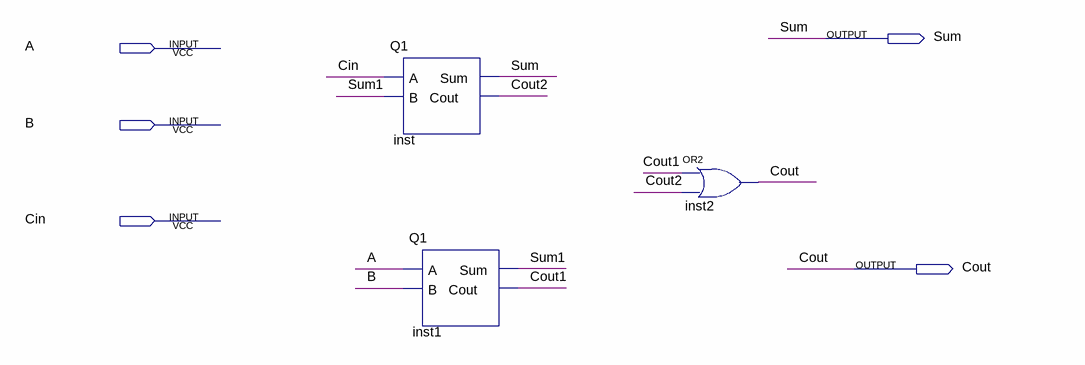
[diagram p0: schematic sheet]
// Quartus schematic FA.bdf as structural Verilog: 3 symbols, 5 pins
module FA (
  input  A,
  input  B,
  input  Cin,
  output Sum,
  output Cout
);

  wire Cout1, Cout2, Sum1;

  Q1 inst (.A(Cin), .B(Sum1), .Sum(Sum), .Cout(Cout2));
  Q1 inst1 (.A(A), .B(B), .Sum(Sum1), .Cout(Cout1));
  or inst2 (Cout, Cout1, Cout2);
endmodule
